# Altium schematic sheet Top_Sheet.SchDoc
size 420 x 297 mm; SheetNumber: 1; SheetTotal: 32
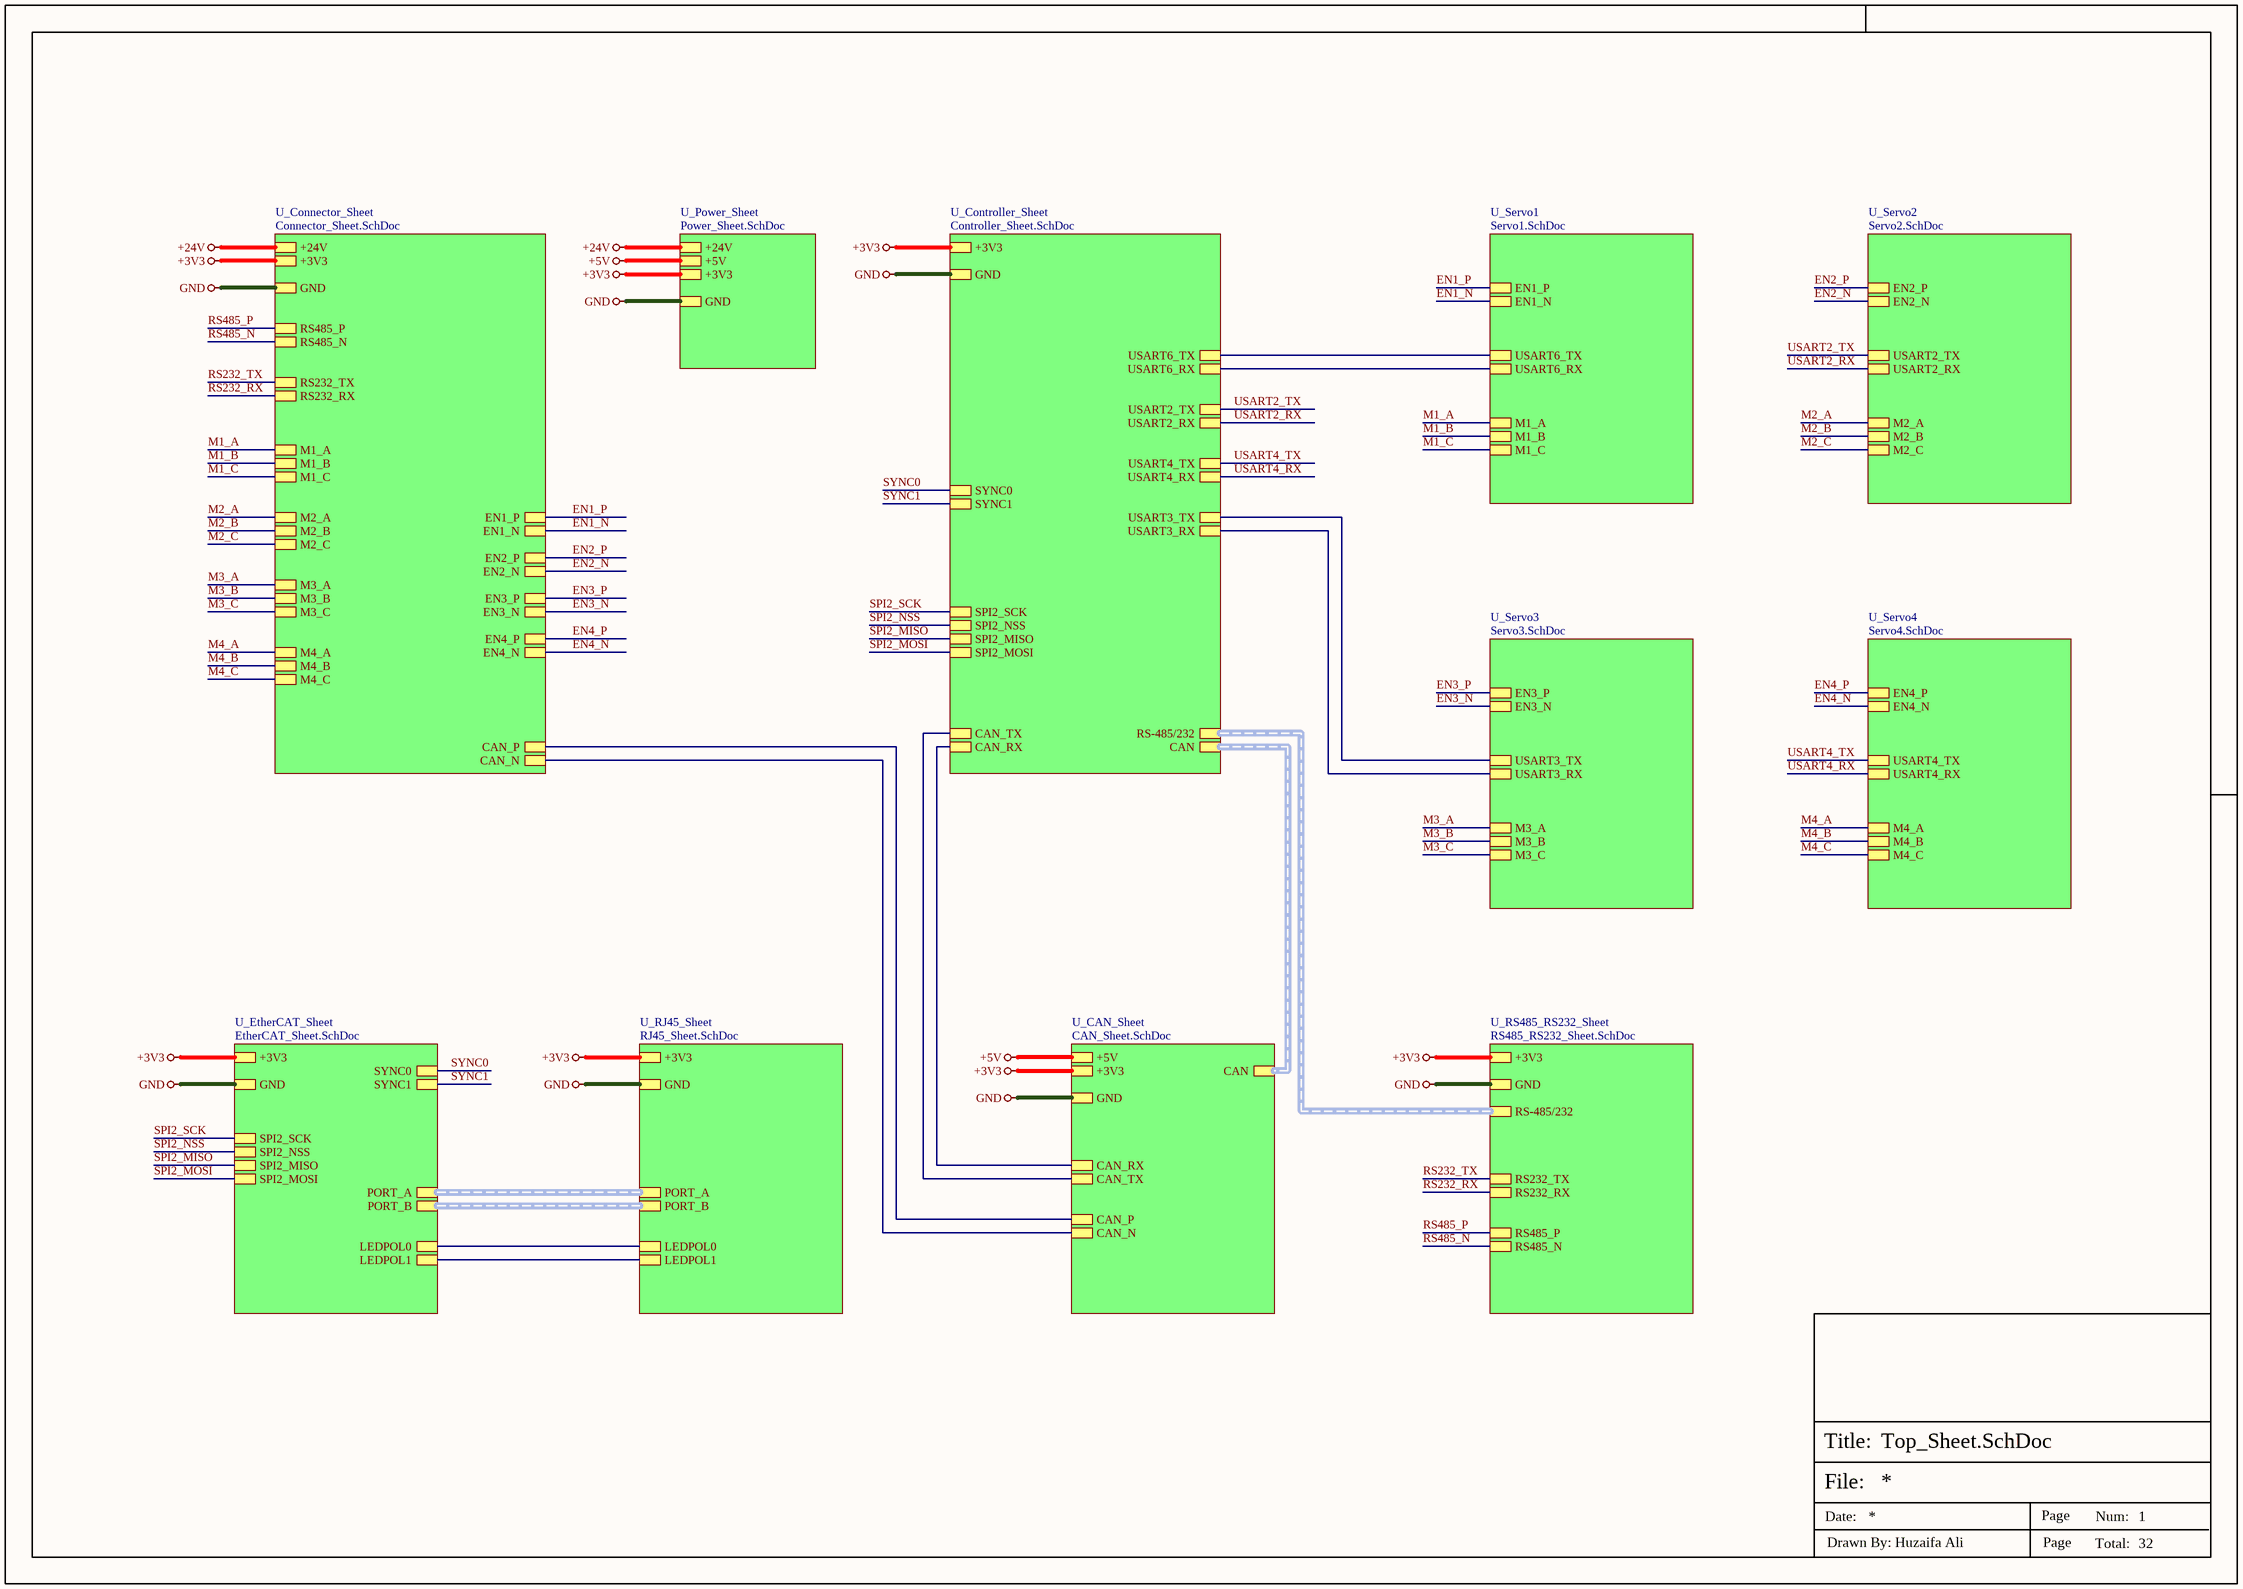
[diagram p0: Top_Sheet.SchDoc]

## Sub-sheets
U_CAN_Sheet = CAN_Sheet.SchDoc: CAN (harness CAN), CAN_RX, CAN_TX, CAN_P, CAN_N, +5V, +3V3, GND
U_Connector_Sheet = Connector_Sheet.SchDoc: M1_A, M1_B, M1_C, +24V, GND, RS485_N, RS485_P, RS232_RX, RS232_TX, CAN_P, CAN_N, EN1_N, EN1_P, M2_A, M2_B, M2_C, M3_A, M3_B, M3_C, M4_A, M4_B, M4_C, +3V3, EN2_N, EN2_P, EN3_N, EN3_P, EN4_N, EN4_P
U_Controller_Sheet = Controller_Sheet.SchDoc: CAN (harness CAN), CAN_RX, CAN_TX, RS-485/232 (harness RS-485/232), +3V3, GND, USART6_RX, USART6_TX, USART2_RX, USART2_TX, USART3_RX, USART3_TX, USART4_RX, USART4_TX, SPI2_SCK, SPI2_NSS, SPI2_MISO, SPI2_MOSI, SYNC1, SYNC0
U_EtherCAT_Sheet = EtherCAT_Sheet.SchDoc: PORT_A (harness PORT_A), PORT_B (harness PORT_B), LEDPOL0, LEDPOL1, SPI2_SCK, SPI2_NSS, SPI2_MISO, SPI2_MOSI, +3V3, GND, SYNC1, SYNC0
U_Power_Sheet = Power_Sheet.SchDoc: +24V, +5V, +3V3, GND
U_RJ45_Sheet = RJ45_Sheet.SchDoc: PORT_A (harness PORT_A), PORT_B (harness PORT_B), LEDPOL0, LEDPOL1, +3V3, GND
U_RS485_RS232_Sheet = RS485_RS232_Sheet.SchDoc: RS485_N, RS485_P, RS232_RX, RS232_TX, RS-485/232 (harness RS-485/232), +3V3, GND
U_Servo1 = Servo1.SchDoc: EN1_P, EN1_N, USART6_RX, USART6_TX, M1_A, M1_B, M1_C
U_Servo2 = Servo2.SchDoc: EN2_P, EN2_N, USART2_RX, USART2_TX, M2_A, M2_B, M2_C
U_Servo3 = Servo3.SchDoc: EN3_P, EN3_N, USART3_RX, USART3_TX, M3_A, M3_B, M3_C
U_Servo4 = Servo4.SchDoc: EN4_P, EN4_N, USART4_RX, USART4_TX, M4_A, M4_B, M4_C

## Nets
+3V3: sheet U_Controller_Sheet/+3V3, sheet U_Power_Sheet/+3V3, sheet U_CAN_Sheet/+3V3, sheet U_RS485_RS232_Sheet/+3V3, sheet U_RJ45_Sheet/+3V3, sheet U_EtherCAT_Sheet/+3V3, sheet U_Connector_Sheet/+3V3
+5V: sheet U_Power_Sheet/+5V, sheet U_CAN_Sheet/+5V
+24V: sheet U_Power_Sheet/+24V, sheet U_Connector_Sheet/+24V
GND: sheet U_Controller_Sheet/GND, sheet U_Power_Sheet/GND, sheet U_CAN_Sheet/GND, sheet U_RS485_RS232_Sheet/GND, sheet U_RJ45_Sheet/GND, sheet U_EtherCAT_Sheet/GND, sheet U_Connector_Sheet/GND
EN1_N: sheet U_Connector_Sheet/EN1_N, sheet U_Servo1/EN1_N
EN1_P: sheet U_Connector_Sheet/EN1_P, sheet U_Servo1/EN1_P
EN2_N: sheet U_Connector_Sheet/EN2_N, sheet U_Servo2/EN2_N
EN2_P: sheet U_Connector_Sheet/EN2_P, sheet U_Servo2/EN2_P
EN3_N: sheet U_Connector_Sheet/EN3_N, sheet U_Servo3/EN3_N
EN3_P: sheet U_Connector_Sheet/EN3_P, sheet U_Servo3/EN3_P
EN4_N: sheet U_Connector_Sheet/EN4_N, sheet U_Servo4/EN4_N
EN4_P: sheet U_Connector_Sheet/EN4_P, sheet U_Servo4/EN4_P
M1_A: sheet U_Connector_Sheet/M1_A, sheet U_Servo1/M1_A
M1_B: sheet U_Connector_Sheet/M1_B, sheet U_Servo1/M1_B
M1_C: sheet U_Connector_Sheet/M1_C, sheet U_Servo1/M1_C
M2_A: sheet U_Connector_Sheet/M2_A, sheet U_Servo2/M2_A
M2_B: sheet U_Connector_Sheet/M2_B, sheet U_Servo2/M2_B
M2_C: sheet U_Connector_Sheet/M2_C, sheet U_Servo2/M2_C
M3_A: sheet U_Connector_Sheet/M3_A, sheet U_Servo3/M3_A
M3_B: sheet U_Connector_Sheet/M3_B, sheet U_Servo3/M3_B
M3_C: sheet U_Connector_Sheet/M3_C, sheet U_Servo3/M3_C
M4_A: sheet U_Connector_Sheet/M4_A, sheet U_Servo4/M4_A
M4_B: sheet U_Connector_Sheet/M4_B, sheet U_Servo4/M4_B
M4_C: sheet U_Connector_Sheet/M4_C, sheet U_Servo4/M4_C
RS232_RX: sheet U_RS485_RS232_Sheet/RS232_RX, sheet U_Connector_Sheet/RS232_RX
RS232_TX: sheet U_RS485_RS232_Sheet/RS232_TX, sheet U_Connector_Sheet/RS232_TX
RS485_N: sheet U_RS485_RS232_Sheet/RS485_N, sheet U_Connector_Sheet/RS485_N
RS485_P: sheet U_RS485_RS232_Sheet/RS485_P, sheet U_Connector_Sheet/RS485_P
SPI2_MISO: sheet U_Controller_Sheet/SPI2_MISO, sheet U_EtherCAT_Sheet/SPI2_MISO
SPI2_MOSI: sheet U_Controller_Sheet/SPI2_MOSI, sheet U_EtherCAT_Sheet/SPI2_MOSI
SPI2_NSS: sheet U_Controller_Sheet/SPI2_NSS, sheet U_EtherCAT_Sheet/SPI2_NSS
SPI2_SCK: sheet U_Controller_Sheet/SPI2_SCK, sheet U_EtherCAT_Sheet/SPI2_SCK
SYNC0: sheet U_Controller_Sheet/SYNC0, sheet U_EtherCAT_Sheet/SYNC0
SYNC1: sheet U_Controller_Sheet/SYNC1, sheet U_EtherCAT_Sheet/SYNC1
USART2_RX: sheet U_Controller_Sheet/USART2_RX, sheet U_Servo2/USART2_RX
USART2_TX: sheet U_Controller_Sheet/USART2_TX, sheet U_Servo2/USART2_TX
USART4_RX: sheet U_Controller_Sheet/USART4_RX, sheet U_Servo4/USART4_RX
USART4_TX: sheet U_Controller_Sheet/USART4_TX, sheet U_Servo4/USART4_TX
(unnamed): sheet U_Controller_Sheet/CAN_RX, sheet U_CAN_Sheet/CAN_RX
(unnamed): sheet U_Controller_Sheet/CAN_TX, sheet U_CAN_Sheet/CAN_TX
(unnamed): sheet U_Controller_Sheet/USART6_RX, sheet U_Servo1/USART6_RX
(unnamed): sheet U_Controller_Sheet/USART6_TX, sheet U_Servo1/USART6_TX
(unnamed): sheet U_Controller_Sheet/USART3_RX, sheet U_Servo3/USART3_RX
(unnamed): sheet U_Controller_Sheet/USART3_TX, sheet U_Servo3/USART3_TX
(unnamed): sheet U_CAN_Sheet/CAN_P, sheet U_Connector_Sheet/CAN_P
(unnamed): sheet U_CAN_Sheet/CAN_N, sheet U_Connector_Sheet/CAN_N
(unnamed): sheet U_RJ45_Sheet/LEDPOL0, sheet U_EtherCAT_Sheet/LEDPOL0
(unnamed): sheet U_RJ45_Sheet/LEDPOL1, sheet U_EtherCAT_Sheet/LEDPOL1

## Buses and harness runs
harness sheet U_CAN_Sheet/CAN = sheet U_Controller_Sheet/CAN
harness sheet U_Controller_Sheet/RS-485/232 = sheet U_RS485_RS232_Sheet/RS-485/232
harness sheet U_EtherCAT_Sheet/PORT_A = sheet U_RJ45_Sheet/PORT_A
harness sheet U_EtherCAT_Sheet/PORT_B = sheet U_RJ45_Sheet/PORT_B

## Notes on the sheet
- File:
- Title:
- Date:
- Page
- Num:
- Total:
- Drawn By: Huzaifa Ali